# EasyEDA schematic SCH_nfc_card_2024-04-11.json
TITLE: Sheet_1; REV: 1.0; Date: 2024-04-10; Sheet: 1/1; Drawn By: aryal.ukesh; Company: Your Company
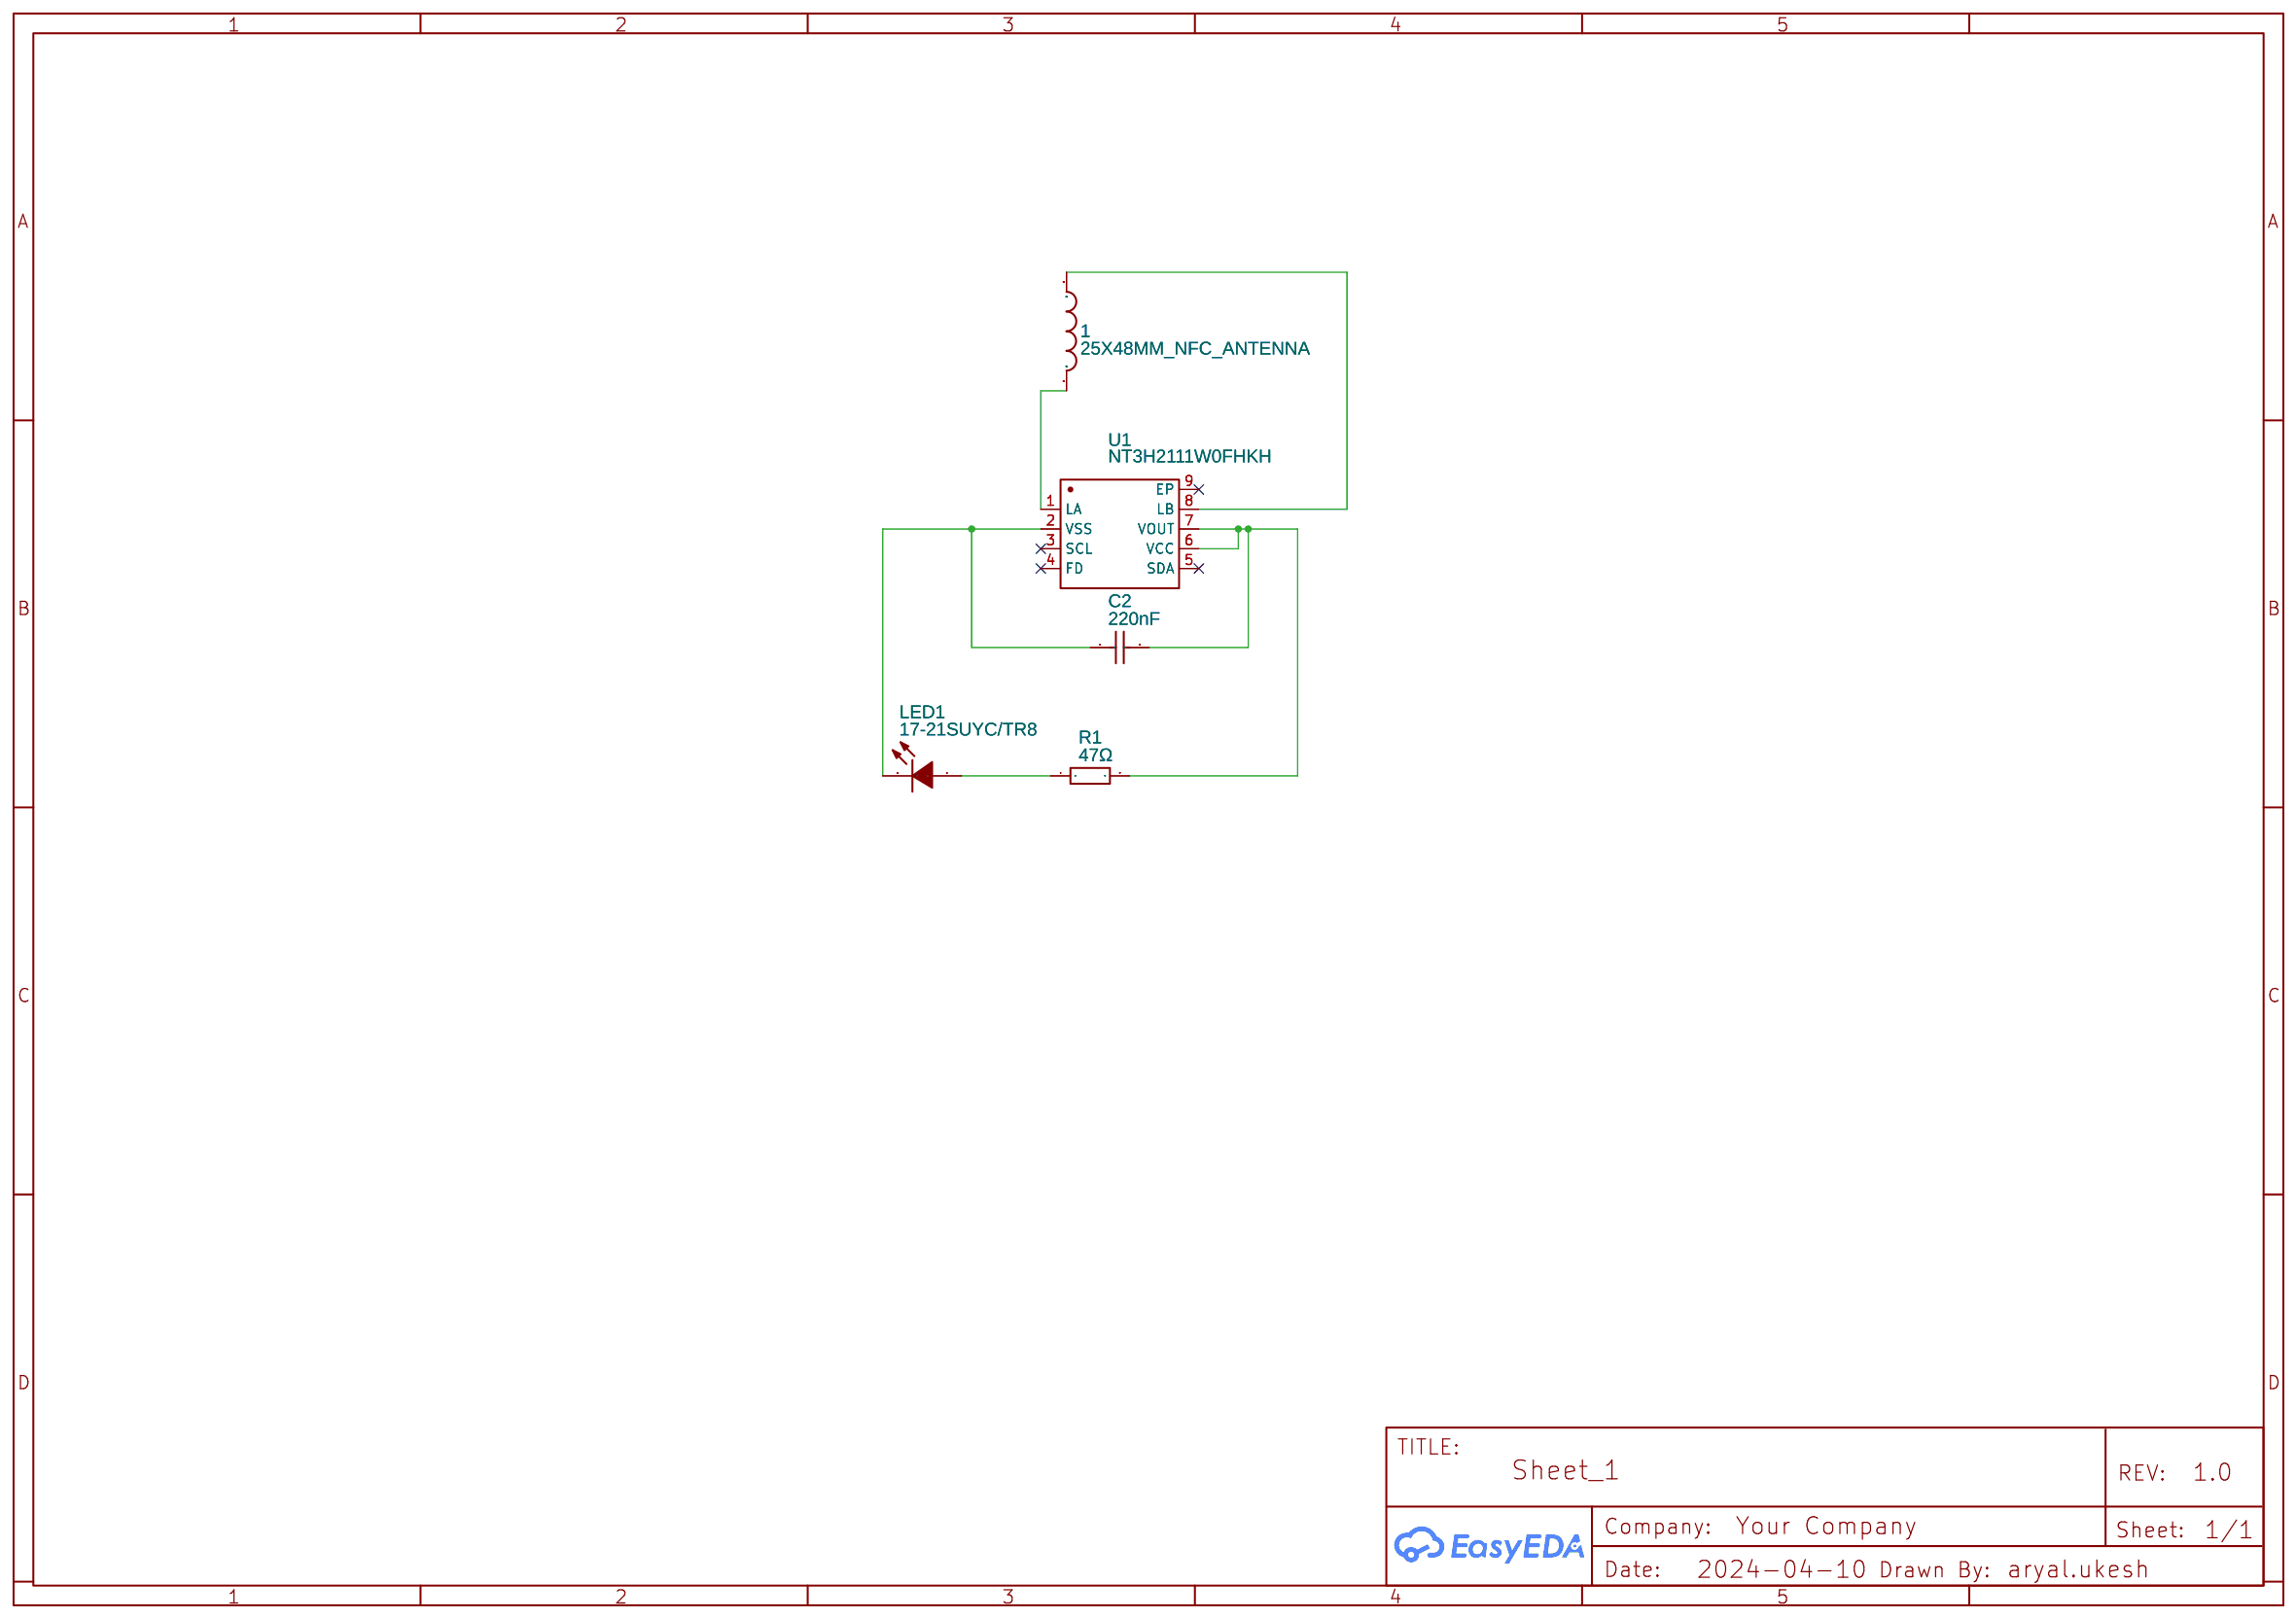
[diagram p0: schematic sheet]

## Parts
1  25X48MM_NFC_ANTENNA  [25X48MM_NFC_ANTENNA]
C2  220nF  [C0805]
LED1  17-21SUYC/TR8  [LED0805-R-RD]
R1  47Ω  [R0805]
U1  NT3H2111W0FHKH  [XQFN-8_L1.6-W1.6-P0.50-BL]

## Library data of the parts
1 = 25X48MM_NFC_ANTENNA: Contributor: maggie.j.liu
C2 = 0805F224Z500: Contributor: LCSC; Supplier: LCSC; Manufacturer: Walsin(华新科); Manufacturer Part: 0805F224Z500CT; Supplier Part: C123632; JLCPCB Part Class: Extended Part
LED1 = 17-21SUYC/TR8: Supplier: LCSC; Manufacturer: KENTO; Manufacturer Part: KT-0805黄灯; Supplier Part: C2296; JLCPCB Part Class: Basic Part
R1 = QR0805F47RP05: Contributor: LCSC; Supplier: LCSC; Supplier Part: C176195; Manufacturer: EVER OHMS(天二科技); Manufacturer Part: QR0805F47R0P05Z; JLCPCB Part Class: Extended Part
U1 = NT3H2111W0FHKH: Contributor: LCSC; Supplier: LCSC; Supplier Part: C710403; Manufacturer: NXP(恩智浦); JLCPCB Part Class: Extended Part

## Nets
Net-(1-P$1): 1.P$1 U1.8(LB)
Net-(1-P$2): 1.P$2 U1.1(LA)
Net-(C2-1): C2.1 LED1.2(-) U1.2(VSS)
Net-(C2-2): C2.2 R1.2 U1.6(VCC) U1.7(VOUT)
Net-(LED1-1): LED1.1(+) R1.1

Not connected (* = marked no-connect by the designer): U1 3(SCL)* 4(FD)* 5(SDA)* 9(EP)*
